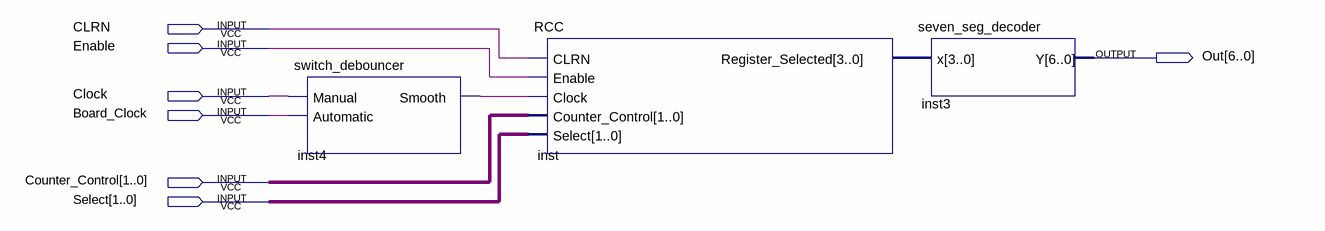
[diagram p0: schematic sheet]
// Quartus schematic RCC_Test.bdf as structural Verilog: 3 symbols, 7 pins
module RCC_Test (
  input  CLRN,
  input  Enable,
  input  Clock,
  input  Board_Clock,
  input  [1:0] Counter_Control,
  input  [1:0] Select,
  output [6:0] Out
);

  wire inst4_smooth;
  wire [3:0] inst_register_selected;

  switch_debouncer inst4 (.Manual(Clock), .Automatic(Board_Clock), .Smooth(inst4_smooth));
  RCC inst (
    .CLRN(CLRN), .Enable(Enable), .Clock(inst4_smooth), .Counter_Control(Counter_Control), .Select(Select),
    .Register_Selected(inst_register_selected));
  seven_seg_decoder inst3 (.x(inst_register_selected), .Y(Out));
endmodule
